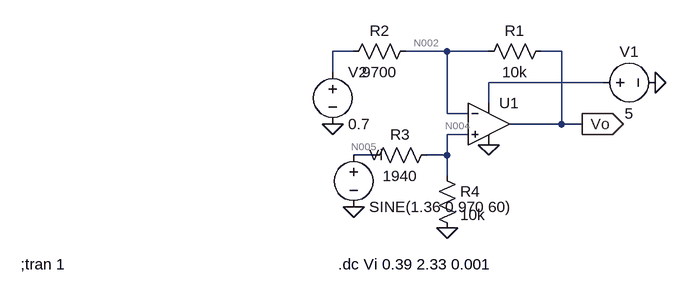
[diagram p0: schematic rail-to-rail.asc]
rail-to-rail.asc, the LTspice schematic file:
Version 4
SHEET 1 880 680
WIRE 304 0 272 0
WIRE 448 0 384 0
WIRE 512 0 448 0
WIRE 624 0 592 0
WIRE 272 32 272 0
WIRE 688 48 512 48
WIRE 512 80 512 48
WIRE 448 96 448 0
WIRE 480 96 448 96
WIRE 624 112 624 0
WIRE 624 112 544 112
WIRE 656 112 624 112
WIRE 480 128 448 128
WIRE 336 160 304 160
WIRE 448 160 448 128
WIRE 448 160 416 160
WIRE 448 192 448 160
FLAG 512 144 0
FLAG 768 48 0
FLAG 656 112 Vo
IOPIN 656 112 Out
FLAG 272 112 0
FLAG 448 272 0
FLAG 304 240 0
SYMBOL res 608 -16 R90
WINDOW 0 0 56 VBottom 2
WINDOW 3 32 56 VTop 2
SYMATTR InstName R1
SYMATTR Value 10k
SYMBOL OpAmps\\UniversalOpamp2 512 112 R0
SYMATTR InstName U1
SYMBOL voltage 672 48 R270
WINDOW 0 32 56 VTop 2
WINDOW 3 -32 56 VBottom 2
WINDOW 123 0 0 Left 0
WINDOW 39 0 0 Left 0
SYMATTR InstName V1
SYMATTR Value 5
SYMBOL res 400 -16 R90
WINDOW 0 0 56 VBottom 2
WINDOW 3 32 56 VTop 2
SYMATTR InstName R2
SYMATTR Value 9700
SYMBOL voltage 272 16 R0
WINDOW 123 0 0 Left 0
WINDOW 39 0 0 Left 0
SYMATTR InstName V2
SYMATTR Value 0.7
SYMBOL res 432 176 R0
SYMATTR InstName R4
SYMATTR Value 10k
SYMBOL res 432 144 R90
WINDOW 0 0 56 VBottom 2
WINDOW 3 32 56 VTop 2
SYMATTR InstName R3
SYMATTR Value 1940
SYMBOL voltage 304 144 R0
WINDOW 123 0 0 Left 0
WINDOW 39 0 0 Left 0
SYMATTR InstName Vi
SYMATTR Value SINE(1.36 0.970 60)
TEXT -208 328 Left 2 !;tran 1
TEXT 280 328 Left 2 !.dc Vi 0.39 2.33 0.001

The netlist it stands for:
* rail-to-rail.asc
R1 Vo N002 10k
XU1 N004 N002 N003 0 Vo level.2 Avol=1Meg GBW=10Meg Slew=10Meg ilimit=25m rail=0 Vos=0 phimargin=45 en=0 enk=0 in=0 ink=0 Rin=500Meg  ; pins IN+ IN- V+ V- OUT
V1 N003 0 5
R2 N002 N001 9700
V2 N001 0 0.7
R4 N004 0 10k
R3 N004 N005 1940
Vi N005 0 SINE(1.36 0.970 60)
;tran 1
.dc Vi 0.39 2.33 0.001
.lib UniversalOpamps2.sub
.backanno
.end

* Results of the author's LTspice run, read from the files saved beside the schematic
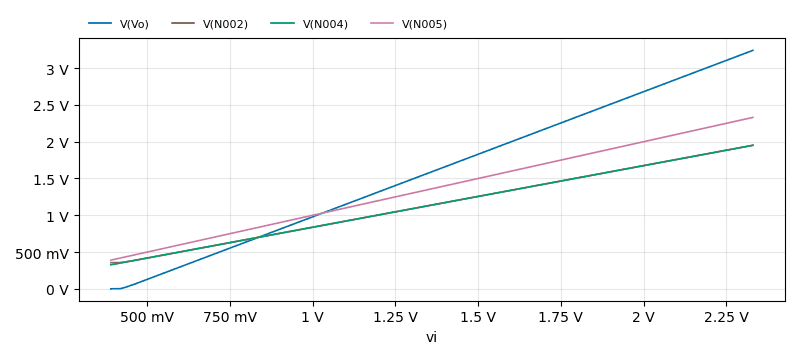
[diagram p1: DC transfer characteristic of rail-to-rail.asc, plotted from the saved traces]
* DC transfer characteristic, 1 run:
*   V(Vo): 590.3 µV at vi=390 mV, 3.242 V at vi=2.33 V, min 590.3 µV, max 3.242 V
*   V(N002): 355.6 mV at vi=390 mV, 1.951 V at vi=2.33 V, min 355.6 mV, max 1.951 V
*   V(N004): 326.6 mV at vi=390 mV, 1.951 V at vi=2.33 V, min 326.6 mV, max 1.951 V
*   V(N005): 390 mV at vi=390 mV, 2.33 V at vi=2.33 V, min 390 mV, max 2.33 V